# Altium schematic sheet MCU_watch.SchDoc: MCU_Watch
size A4; Author: Sajitha Madugalle; Revision: 1; SheetNumber: 11; SheetTotal: 11
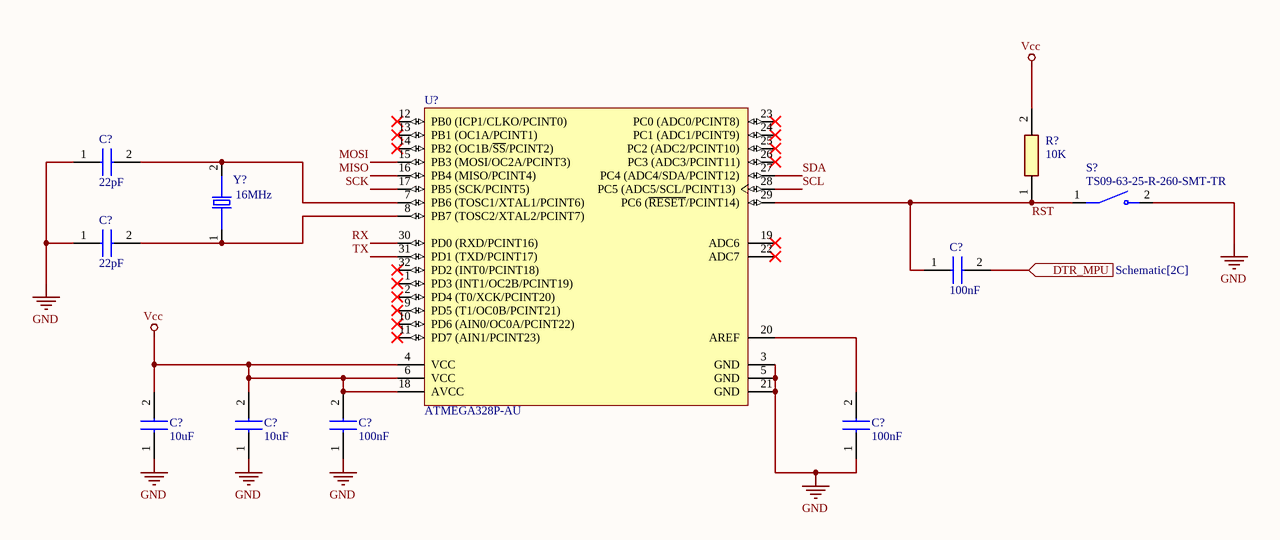
[diagram p0: MCU_watch.SchDoc]

## Parts
(Parts that share a designator on the sheet are numbered #1, #2 ... from top to bottom, then left to right.)
C?#1  22pF  [C0805]
C?#2  22pF  [C0805]
C?#3  100nF  [CAPC2013X137N]
C?#4  10uF  [CAPC2012X145N]
C?#5  10uF  [CAPC2012X145N]
C?#6  100nF  [CAPC2013X137N]
C?#7  100nF  [CAPC2013X137N]
R?  10K  [RESC2013X65N]
S?  TS09-63-25-R-260-SMT-TR  [SW_TS09-63-25-R-260-SMT-TR]
U?  ATMEGA328P-AU  [ATML-32A_M]
Y?  16MHz  [XTAL_FOXSDLF/160-20]

## Ports
DTR_MPU (in, see Schematic[2C])

## Nets
GND: C?#1.1 C?#2.1 C?#4.1 C?#5.1 C?#6.1 C?#7.1 S?.2 U?.3(GND) U?.5(GND) U?.21(GND)
Vcc: C?#4.2 C?#5.2 C?#6.2 R?.2 U?.4(VCC) U?.6(VCC) U?.18(AVCC)
DTR_MPU: C?#3.2 ; port DTR_MPU
MISO: U?.16(PB4_(MISO/PCINT4))
MOSI: U?.15(PB3_(MOSI/OC2A/PCINT3))
RST: C?#3.1 R?.1 S?.1 U?.29(PC6_(~{RESET}/PCINT14))
RX: U?.30(PD0_(RXD/PCINT16))
SCK: U?.17(PB5_(SCK/PCINT5))
SCL: U?.28(PC5_(ADC5/SCL/PCINT13))
SDA: U?.27(PC4_(ADC4/SDA/PCINT12))
TX: U?.31(PD1_(TXD/PCINT17))
NetC?#1_2: C?#1.2 U?.7(PB6_(TOSC1/XTAL1/PCINT6)) Y?.2
NetC?#2_2: C?#2.2 U?.8(PB7_(TOSC2/XTAL2/PCINT7)) Y?.1
NetC?#7_2: C?#7.2 U?.20(AREF)

Not connected (* = marked no-connect by the designer): U? 1(PD3_(INT1/OC2B/PCINT19))* 2(PD4_(T0/XCK/PCINT20))* 9(PD5_(T1/OC0B/PCINT21))* 10(PD6_(AIN0/OC0A/PCINT22))* 11(PD7_(AIN1/PCINT23))* 12(PB0_(ICP1/CLKO/PCINT0))* 13(PB1_(OC1A/PCINT1))* 14(PB2_(OC1B/~{SS}/PCINT2))* 19(ADC6)* 22(ADC7)* 23(PC0_(ADC0/PCINT8))* 24(PC1_(ADC1/PCINT9))* 25(PC2_(ADC2/PCINT10))* 26(PC3_(ADC3/PCINT11))* 32(PD2_(INT0/PCINT18))*

## Notes on the sheet
- Title:
- Size:
- Document Number :
- Revision
- Drawn by:
- Checked by:
- Date:
- A4
- Time:
- Aprooved by:
- Sheet:
- of
- File:

## Library data of the parts
C?#1 C?#2 = C0805X220J1GACTU: Capacitor; Manufacturer_Name: KEMET; Datasheet Link: https://content.kemet.com/datasheets/KEM_C1062_C0G_FT-CAP_SMD.pdf; Height: 1.1mm; Manufacturer_Part_Number: C0805X220J1GACTU; Mouser Part Number: 80-C0805X220J1GACTU; Mouser Price/Stock: https://www.mouser.co.uk/ProductDetail/KEMET/C0805X220J1GACTU?qs=ds50AKTGxA9gC%252BgDVpAXPw%3D%3D
C?#3 C?#6 C?#7 = 0805B104K500NT: Capacitor; Manufacturer_Name: Novacap; Datasheet Link: https://componentsearchengine.com/Datasheets/1/0805B104K500NT.pdf; Height: 1.37mm; Manufacturer_Part_Number: 0805B104K500NT; Mouser Part Number: 767-0805B104K500NT; Mouser Price/Stock: https://www.mouser.com/Search/Refine.aspx?Keyword=767-0805B104K500NT
C?#4 C?#5 = GCM21BC71E106KE36K: Capacitor; Manufacturer_Name: Murata Electronics; Datasheet Link: https://search.murata.co.jp/Ceramy/image/img/A01X/G101/ENG/GRM21BC71E106KE11-01.pdf; Height: 1.45mm; Manufacturer_Part_Number: GCM21BC71E106KE36K; Mouser Part Number: 81-GCM21B71E106KE36K; Mouser Price/Stock: https://www.mouser.co.uk/ProductDetail/Murata-Electronics/GCM21BC71E106KE36K?qs=By6Nw2ByBD3dg3yZS4KZOA%3D%3D
R? = 0805W8F1002T5E: Resistor; Manufacturer_Name: UniOhm; Height: 0.65mm; Manufacturer_Part_Number: 0805W8F1002T5E
U? = CMP-020-00003-3: 8-Bit Microcontroller with 32 KBytes In-System Programmable Flash, 23 I/Os, -40 to 85 degC, 32-Pin TQFP (32A), RoHS, Tray; Manufacturer: Atmel; PWM Channels: 6; Frequency: 20MHz; RAM Size: 2KB; ADC Channels: 8; Max Supply Voltage: 5.5V; Density: 32KB; USB Channels: 0; I/Os: 23; Min Supply Voltage: 1.8V; Interface: USART; Package Reference: 32A; Package Description: 32-Pin Thin Profile Plastic Quad Flat Package, Body 7 x 7 mm, Pitch 0.8 mm; Max Operating Temperature: 85°C; Mounting Technology: SM; Datasheet URL: http://www.atmel.com/images/Atmel-8271-8-bit-AVR-Microcontroller-ATmega48A-48PA-88A-88PA-168A-168PA-328-328P_datasheet_Complete.pdf; Pins: 32; Packaging: Tray; RoHS Compliant: True; Max Clock Frequency: 20MHz; Ethernet Channels: 0; Clock Frequency: 20MHz; Case/Package: TQFP; Manufacturer URL: http://www.atmel.com/; Datasheet Version: Rev. 8271J, 11/2015; Package Quantity: 250; Min Operating Temperature: -40°C
Y? = FOXSDLF/160-20: Microprocessor, Crystal; 16 Mhz; + 30 Ppm @ Degc; 7 Pf (Max.); 20 Pf; -20 Deg; MF: Fox Electronics; Package: HC49SD Fox Electronics; Price: None; Value: *; SnapEDA_Link: https://www.snapeda.com/parts/FOXSDLF/160-20/Fox+Electronics/view-part/?ref=snap; MP: FOXSDLF/160-20; Availability: In Stock; Check_prices: https://www.snapeda.com/parts/FOXSDLF/160-20/Fox+Electronics/view-part/?ref=eda
S? = TS09-63-25-R-260-SMT-TR: Availability: Unavailable; Price: None; Package: None; Value: *; MP: TS09-63-25-R-260-SMT-TR